# Altium schematic sheet Boost_6V.SchDoc
size Letter; SheetNumber: 10; SheetTotal: 12
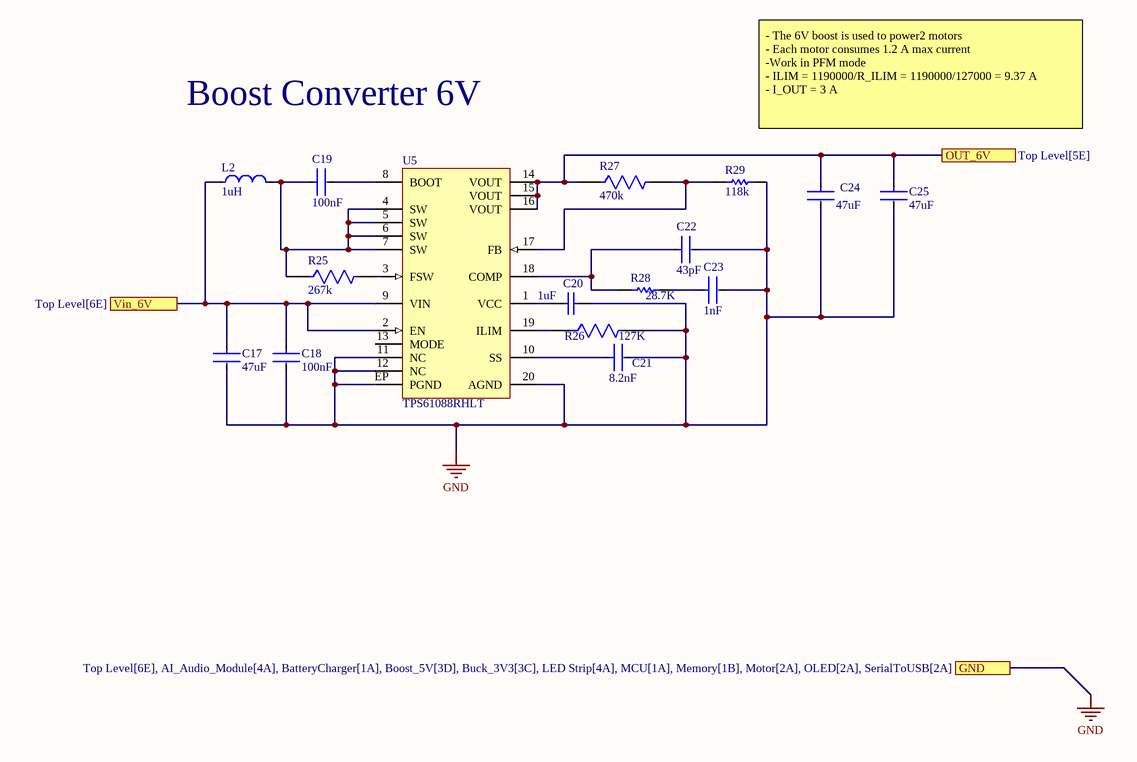
[diagram p0: Boost_6V.SchDoc]

## Parts
C17  47uF  [FP-C0805C476M9PACTU-MFG]
C18  100nF  [FP-CC0603-DA-MFG]
C19  100nF  [FP-CGA3E-0_3-0_1-IPC_A]
C20  1uF  [CAPC1608X87X35LL15T15]
C21  8.2nF  [FP-C0805C-DN-MFG]
C22  43pF  [FP-C0603C-CF-MFG]
C23  1nF  [FP-0603-L_1_6_0_15-W_0_81-IPC_A]
C24  47uF  [FP-C0805C476M9PACTU-MFG]
C25  47uF  [FP-C0805C476M9PACTU-MFG]
L2  1uH  [FP-LQW21HN_00-MFG]
R25  267k  [FP-RP732A-MFG]
R26  127K  [FP-CRCW0805-e3-MFG]
R27  470k  [FP-CRGCQ0805-IPC_C]
R28  28.7K  [RESC1609X50X30NL10T20]
R29  118k  [RESC2013X70X40NL20T20]
U5  TPS61088RHLT  [FP-RHL0020A-MFG]

## Ports
GND (see Top Level[6E], AI_Audio_Module[4A], BatteryCharger[1A], Boost_5V[3D], Buck_3V3[3C], LED Strip[4A], MCU[1A], Memory[1B], Motor[2A], OLED[2A], SerialToUSB[2A]), OUT_6V (see Top Level[5E]), Vin_6V (see Top Level[6E])

## Nets
GND: C17.2 C18.2 C20.2 C21.2 C22.2 C23.2 C24.2 C25.2 R26.2 R29.2 U5.11(NC) U5.12(NC) U5.20(AGND) U5.EP(PGND) ; port GND
OUT_6V: C24.1 C25.1 R27.1 U5.14(VOUT) U5.15(VOUT) U5.16(VOUT) ; port OUT_6V
Vin_6V: C17.1 C18.1 L2.1 U5.2(EN) U5.9(VIN) ; port Vin_6V
NetC19_1: C19.1 L2.2 R25.1 U5.4(SW) U5.5(SW) U5.6(SW) U5.7(SW)
NetC19_2: C19.2 U5.8(BOOT)
NetC20_1: C20.1 U5.1(VCC)
NetC21_1: C21.1 U5.10(SS)
NetC22_1: C22.1 R28.1 U5.18(COMP)
NetC23_1: C23.1 R28.2
NetR25_2: R25.2 U5.3(FSW)
NetR26_1: R26.1 U5.19(ILIM)
NetR27_2: R27.2 R29.1 U5.17(FB)

Not connected (* = marked no-connect by the designer): U5 13(MODE)

## Notes on the sheet
- Boost Converter 6V
- - The 6V boost is used to power2 motors
  - Each motor consumes 1.2 A max current
  -Work in PFM mode
  - ILIM = 1190000/R_ILIM = 1190000/127000 = 9.37 A
  - I_OUT = 3 A
- Title:
- Desc:
- Size:
- Letter
- Auth:
- Proj:
- Sheet
- of
- www.seas.upenn.edu
- Electrical and Systems Engineering

## Library data of the parts
C17 C24 C25 = CMP-2007-01008-2: CAP CER 47UF 6.3V X5R 0805; Dielectric Material: Ceramic; Dissipation Factor: 5%; Tolerance: 20%; Case Code (Imperial): 0805; Mount: PCB; Width: 1.2mm; Package Quantity: 3000; Radiation Hardening: No; Packaging: Tape and Reel; Termination: SMD/SMT; Series: C0805C; Voltage: 6.3V; Depth: 1.25mm; Dielectric: X5R; Case Code (Metric): 2012; Length: 2mm; Case/Package: 0805; REACH SVHC: No SVHC; Voltage Rating (DC): 6.3V; Capacitance: 47uF; RoHS Compliant: Yes; Height: 1.25mm; Construction: Flat; Number of Pins: 2; Voltage Rating: 6.3V; Max Operating Temperature: 85°C; Min Operating Temperature: -55°C
C18 = CMP-2000-05002-2: CAP CER 0.1UF 16V X7R 0603; Manufacturer Part Number: CC0603KRX7R7BB104; Manufacturer: YAGEO; Tolerance: 0.1; Temperature Coefficient: 15%; Material: Ceramic; Voltage Rating: 16 V; Package: CC0603-DA; ComponentLink2Description: Datasheet; Octopart: https://octopart.com/cc0603krx7r7bb104-yageo-192941; Temperature Range High: +125°C; Digikey Description: CAP CER 0.1UF 16V X7R 0603; Value: 100 nF; Voltage: 16 V; Device Class L2: Capacitors; Height: 0.9mm; Temperature: -55°C to +125°C; Device Class L1: Passive Components; Device Class L3: Ceramic Capacitors; ComponentLink2URL: http://www.yageo.com/documents/recent/UPY-GPHC_X7R_6.3V-to-50V_18.pdf; Footprint Url: http://www.yageo.com/exep/pages/download/literatures/UPY-C_GEN_24.pdf; RoHS: TRUE; Temperature Range Low: -55°C; Temperature Characteristic: X7R; Lead Free: Yes; Capacitance: 100 nF; Category: Cap; Mouser Description: Multilayer Ceramic Capacitor, CC Series, 0.1 - F, - 10%, X7R, 16 V, 0603 [1608 Metric]; Automotive: No
C19 = CMP-2000-07546-2: Cap Ceramic 100nF 50V X7R 10% Pad SMD 0603 +125°C Automotive T/R; Weight: 7.1E-05oz; Composition: Ceramic; Max Operating Temperature: 125°C; Termination: SMD/SMT; Dielectric: X7R; Length: 1.6mm; Package Quantity: 1; REACH SVHC: No SVHC; Lead Free: Lead Free; Case Code (Metric): 1608; Min Operating Temperature: -55°C; Packaging: Tape and Reel; Tolerance: 10%; Voltage Rating: 50V; Case Code (Imperial): 0603; Capacitance: 100nF; Case/Package: 0603; Voltage Rating (DC): 50V; Depth: 0.8mm; Radiation Hardening: No; Ratings: AEC-Q200; Mount: Surface Mount; Voltage: 50V; Thickness: 0.035inch; Width: 0.8mm; Height: 0.8mm
C20 = CMP-2006-03713-1: Part Number: C0603C105K3RACTU; Manufacturer: Kemet
C21 = CMP-2007-03316-2: CAP CER 8200PF 200V C0G/NP0 0805; Manufacturer Part Number: C0805C822J2GACAUTO; Manufacturer: KEMET; Temperature Coefficient: 30ppm/°C; Material: Ceramic; Temperature Characteristic: C0G; Value: 8,200 pF; Tolerance: 0.05; ComponentLink2URL: https://content.kemet.com/datasheets/KEM_C1003_C0G_SMD.pdf; Digikey Description: CAP CER 8200PF 200V C0G/NP0 0805; Height: 0.88mm; Voltage Rating: 200 V; Temperature: -55°C to +125°C; RoHS: TRUE; Temperature Range Low: -55°C; Package: C0805C-DN; ComponentLink2Description: Datasheet; Device Class L2: Capacitors; Device Class L3: Ceramic Capacitors; Octopart: https://octopart.com/c0805c822j2gacauto-kemet-46733249; Automotive: No; Device Class L1: Passive Components; Category: Cap; Ipc Land Pattern Name: CAPC200125X78; Capacitance: 8,200 pF; Lead Free: Yes; Temperature Range High: +125°C
C22 = CMP-1035-01031-3: CAP CER 43PF 50V 5% NP0 0603; Manufacturer Part Number: C0603C430J5GACTU; Manufacturer: KEMET; Tolerance: 0.05; Automotive Grade: Grade 1; Material: Ceramic; Temperature Characteristic: C0G; Temperature Coefficient: 30ppm/°C; RoHS: TRUE; Height: 0.87mm; Octopart: https://octopart.com/c0603c430j5gactu-kemet-9138600; Device Class L2: Capacitors; Lead Free: Yes; Device Class L3: Ceramic Capacitors; ComponentLink2URL: https://api.kemet.com/component-edge/download/datasheet/C0603C100J5GACAUTO.pdf; Device Class L1: Passive Components; Digikey Description: CAP CER 43PF 50V 5% NP0 0603; Category: Cap; Temperature Range Low: -55°C; Value: 43 pF; ComponentLink2Description: Datasheet; Voltage Rating: 50 V; Mouser Description: Multilayer Ceramic Capacitor, C Series, 43 Pf, - 5%, C0g / Np0, 50 V, 0603 [1608 Metric] Rohs Compliant: Yes; Temperature Range High: +125°C; Package: C0603C-CF; Temperature: -55°C to +125°C; Capacitance: 43 pF; Automotive: Yes
C23 = CMP-2006-04378-2: General Purpose Ceramic Capacitor, 0603, 1nF, 10%, X7R, 15%, 50V; Case Code (Metric): 1608; Min Operating Temperature: -55°C; Weight: 7.1E-05oz; Series: -; Capacitance: 1nF; RoHS Compliant: Yes; Radiation Hardening: No; Height: 0.9mm; Mount: Surface Mount; REACH SVHC: No SVHC; Lead Free: Lead Free; Depth: 0.81mm; Voltage: 50V; Number of Pins: 2; Voltage Rating: 50V; Max Operating Temperature: 125°C; Termination: SMD/SMT; Construction: Flat; Case Code (Imperial): 0603; Dielectric: X7R; Width: 0.032inch; Tolerance: 10%; Case/Package: 0603; Contact Plating: Tin; Packaging: Tape and Reel; Voltage Rating (DC): 50V; Dielectric Material: Ceramic; Package Quantity: 4000; Thickness: 0.035inch; Length: 1.6mm
L2 = CMP-06042-000167-1: FIXED IND 1UH 115MA 2.86 OHM SMD; Q Factor: 35; Shielding: Unshielded; Self Resonant Frequency: 450MHz; Core Material: Ferrite; DC Resistance (DCR): 2.86R; Tolerance: 5%; Test Frequency: 10MHz; Resistor Type: Wirewound; DC Current: 115mA; Radiation Hardening: No; Length: 2mm; Packaging: Tape and Reel; Current Rating: 115mA; Weight: 0.000282oz; Case/Package: 0805; Case Code (Imperial): 0805; Case Code (Metric): 2012; Inductance: 1uH; Military Standard: Not; Depth: 1.4mm; Min Operating Temperature: -40°C; Mount: Surface Mount; Package Quantity: 3000; Termination: SMD/SMT; Height: 0.9mm; Max DC Current: 115mA; Max Operating Temperature: 85°C; Height - Seated (Max): 0.039inch; Lead Free: Lead Free; Width: 1.5mm
R25 = CMP-03211-008573-2: Surface Mount Resistors, Precision Resistor, 2 Terminations, Size Code 0805, Cut Tape Length, .1%, Thin Film, 10K 0.1% 10PPM; Voltage Rating: 150V; Number of Resistors: 1; Temperature Coefficient: 15ppm/°C; Power Rating: 125mW; Resistance: 267kR; Tolerance: 0.1%; Packaging: Tape and Reel; Min Operating Temperature: -55°C; Mount: Surface Mount; Termination: Solder; Length: 2mm; Case Code (Imperial): 0805; Package Quantity: 1000; Number of Terminations: 2; Case/Package: 0805; Case Code (Metric): 2012; Weight: 0.000194oz; Height: 0.55mm; Max Operating Temperature: 155°C; Width: 1.25mm; ELV: Compliant
R26 = CMP-2001-04290-2: RES Thick Film, 127kΩ, 1%, 0.125W, 100ppm/°C, 0805; Voltage Rating (DC): 150V; Max Power Dissipation: 125mW; Resistance: 127kR; Case Code (Metric): 2012; Length: 2mm; Packaging: Tape and Reel; Contact Plating: Tin; Height: 0.02inch; Features: Automotive AEC-Q200; Width: 1.25mm; Composition: Thick Film; Case/Package: 0805; Weight: 0.000194oz; Case Code (Imperial): 0805; Radiation Hardening: No; Number of Terminations: 2; Lead Free: Lead Free; Package Quantity: 10; Tolerance: 1%; Power Rating: 125mW; Voltage Rating: 150V; Number of Pins: 2; Military Standard: Not; Temperature Coefficient: 100ppm/°C; Max Operating Temperature: 155°C; Depth: 1.25mm; Min Operating Temperature: -55°C
R27 = CMP-03211-004111-1: CRGCQ0805 470KΩ 0.125W ±100ppm/°C 5% 150V; Manufacturer Part Number: CRGCQ0805J470K; Manufacturer: TE Connectivity; Tolerance: 0.05; Ambient Temperature Range High: +70°C; Power Rating: 0.125W; Lead Free: Yes; RoHS: TRUE; Height: 0.65mm; Ipc Land Pattern Name: RESC200125X55; Automotive Grade: Grade 1294; Category: Res; Device Class L2: Resistors; Temperature Range Low: -55°C; Series: CRGCQ; Octopart: https://octopart.com/crgcq0805j470k-te+connectivity-91018228; ComponentLink2Description: Datasheet; Package: CRGCQ0805; Device Class L1: Passive Components; Temperature Range High: +155°C; Voltage Rating: 150V; Device Class L3: Chip SMD Resistors; Value: 470KΩ; Automotive: Yes; Temperature Coefficient: ±100ppm/°C; ComponentLink2URL: https://www.te.com/commerce/DocumentDelivery/DDEController?Action=showdoc&DocId=Data+Sheet%7F1773204-3%7F1%7Fpdf%7FEnglish%7FENG_DS_1773204-3_1.pdf%7F4-2176341-1303; Temperature: -55°C to +155°C; Composition: Thick Film; Resistance: 470KΩ
R28 = CMP-2000-03154-1: Manufacturer: Vishay Dale; Part Number: CRCW060328K7FKEA
R29 = CMP-2001-04400-1: Part Number: ERJ-6ENF1183V; Manufacturer: Panasonic
U5 = CMP-00676-1: Switching Regulator, Current-mode, 13A, 2200kHz Switching Freq-Max, PQCC20; Control Technique: PULSE WIDTH MODULATION; Max Supply Voltage: 12V; Nominal Output Voltage: 9V; Min Input Voltage: 2.7V; Nominal Supply Voltage: 3.6V; Channels: 1; Frequency: 2.2MHz; Switcher Configuration: BOOST; Package Body Material: Plastic; RoHS Compliant: Yes; Terminal Position: QUAD; Surface Mount: Yes; Case/Package: HVQCCN; Height - Seated (Max): 1mm; JESD-609 Code: e4; Terminal Form: No Lead; Terminal Finish: Nickel; Package Style: CHIP CARRIER, HEAT SINK/SLUG, VERY THIN PROFILEMeter; Pins: 20; Length: 4.5mm; Control Mode: CURRENT-MODE; Moisture Sensitivity Level: 2; Throw Configuration: SWITCHING REGULATOR; Min Operating Temperature: -40°C; Reach SVHC Compliant: Yes; Temperature Grade: INDUSTRIAL; Width: 3.5mm; Max Operating Temperature: 85°C; Package Shape: Rectangular; Max Output current: 13A; Terminal Pitch: 0.5mm